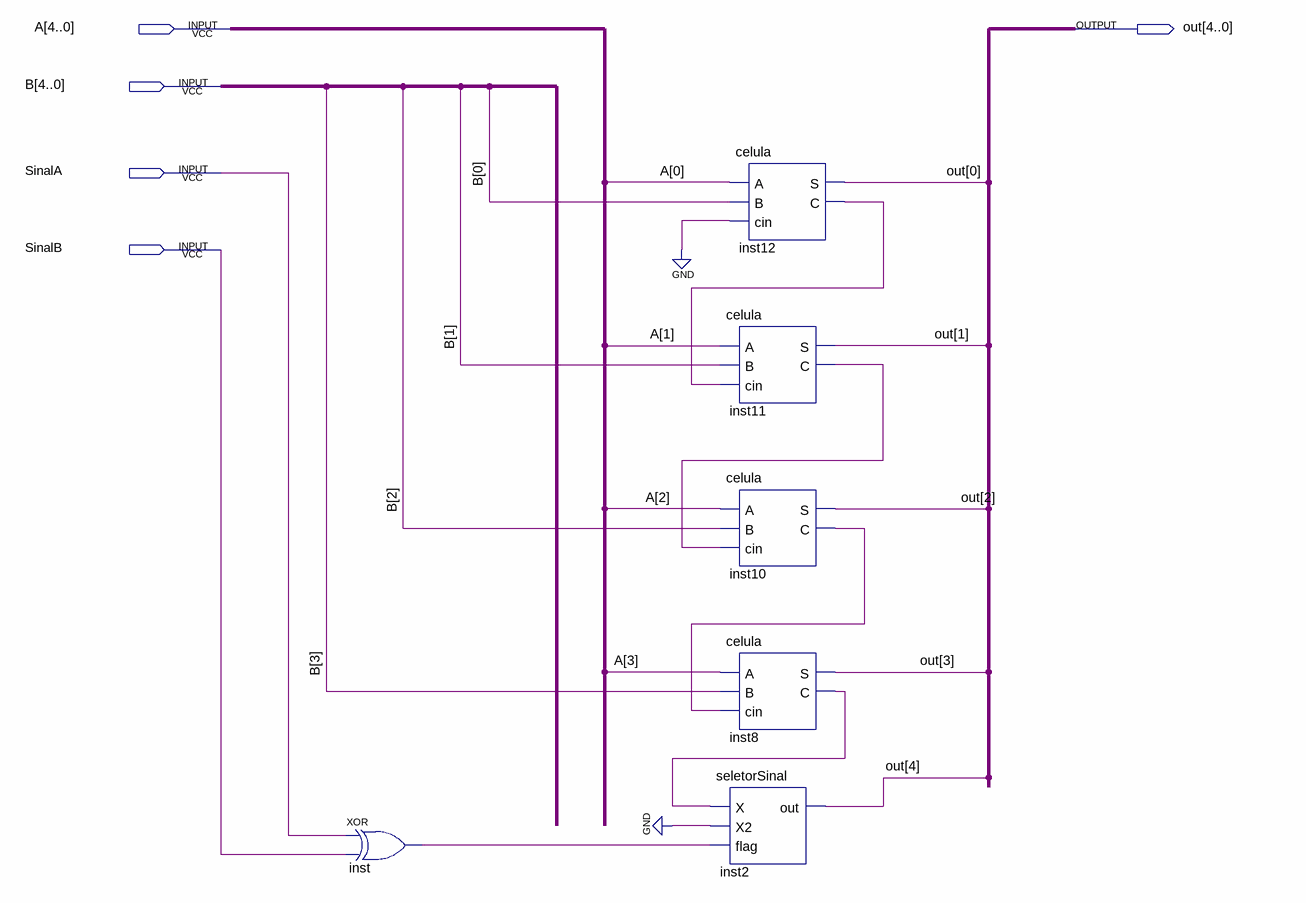
[diagram p0: schematic sheet]
// Quartus schematic somadorMagnitude.bdf as structural Verilog: 6 symbols, 5 pins
module somadorMagnitude (
  input  [4:0] A,
  input  [4:0] B,
  input  SinalA,
  input  SinalB,
  output [4:0] out
);

  wire inst8_c, inst10_c, inst11_c, inst12_c, inst_out;

  xor inst (inst_out, SinalA, SinalB);
  seletorSinal inst2 (.X(inst8_c), .X2(1'b0), .flag(inst_out), .out(out[4]));
  celula inst12 (.A(A[0]), .B(B[0]), .cin(1'b0), .S(out[0]), .C(inst12_c));
  celula inst11 (.A(A[1]), .B(B[1]), .cin(inst12_c), .S(out[1]), .C(inst11_c));
  celula inst10 (.A(A[2]), .B(B[2]), .cin(inst11_c), .S(out[2]), .C(inst10_c));
  celula inst8 (.A(A[3]), .B(B[3]), .cin(inst10_c), .S(out[3]), .C(inst8_c));
endmodule
